# Altium schematic sheet RS485.SchDoc
size A4; SheetNumber: 3; SheetTotal: 8
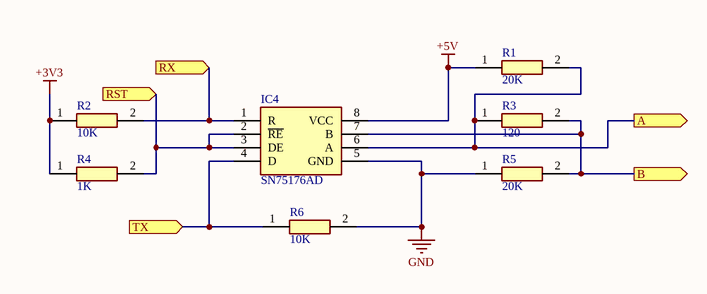
[diagram p0: RS485.SchDoc]

## Parts
IC4  SN75176AD  [SOIC127P600X175-8N]
R1  20K  [RESC3216X75N]
R2  10K  [RESC3216X75N]
R3  120  [RESC3216X75N]
R4  1K  [RESC3216X75N]
R5  20K  [RESC3216X75N]
R6  10K  [RESC3216X75N]

## Ports
A (out), B (out), RST (in), RX (in), TX (in)

## Nets
+3V3: R2.1 R4.1
+5V: IC4.8(VCC) R1.1
GND: IC4.5(GND) R5.1 R6.2
A: IC4.6(A) R1.2 R3.1 ; port A
B: IC4.7(B) R3.2 R5.2 ; port B
RST: IC4.2(~{RE}) IC4.3(DE) R4.2 ; port RST
RX: IC4.1(R) R2.2 ; port RX
TX: IC4.4(D) R6.1 ; port TX

## Library data of the parts
IC4 = SN75176AD: Integrated Circuit; Manufacturer_Name: Texas Instruments; Datasheet Link: http://www.ti.com/lit/ds/symlink/sn75176a.pdf; Height: 1.75mm; Manufacturer_Part_Number: SN75176AD; Mouser Part Number: 595-SN75176AD; Mouser Price/Stock: https://www.mouser.co.uk/ProductDetail/Texas-Instruments/SN75176AD?qs=FetendrIl6upbSVFRObzhQ%3D%3D; Arrow Part Number: SN75176AD; Arrow Price/Stock: https://www.arrow.com/en/products/sn75176ad/texas-instruments?region=nac
R1-R6 = CR1206-F_-2R00ELF: Resistor; Manufacturer_Name: Bourns; Manufacturer_Part_Number: CR1206-F/-2R00ELF; Height: 0.75mm; Mouser Part Number: 652-CR1206-F/2R00ELF; Mouser Price/Stock: https://www.mouser.co.uk/ProductDetail/Bourns/CR1206-F-2R00ELF?qs=W%2FMpXkg%252BdQ47Z%2FeZv1nDSg%3D%3D